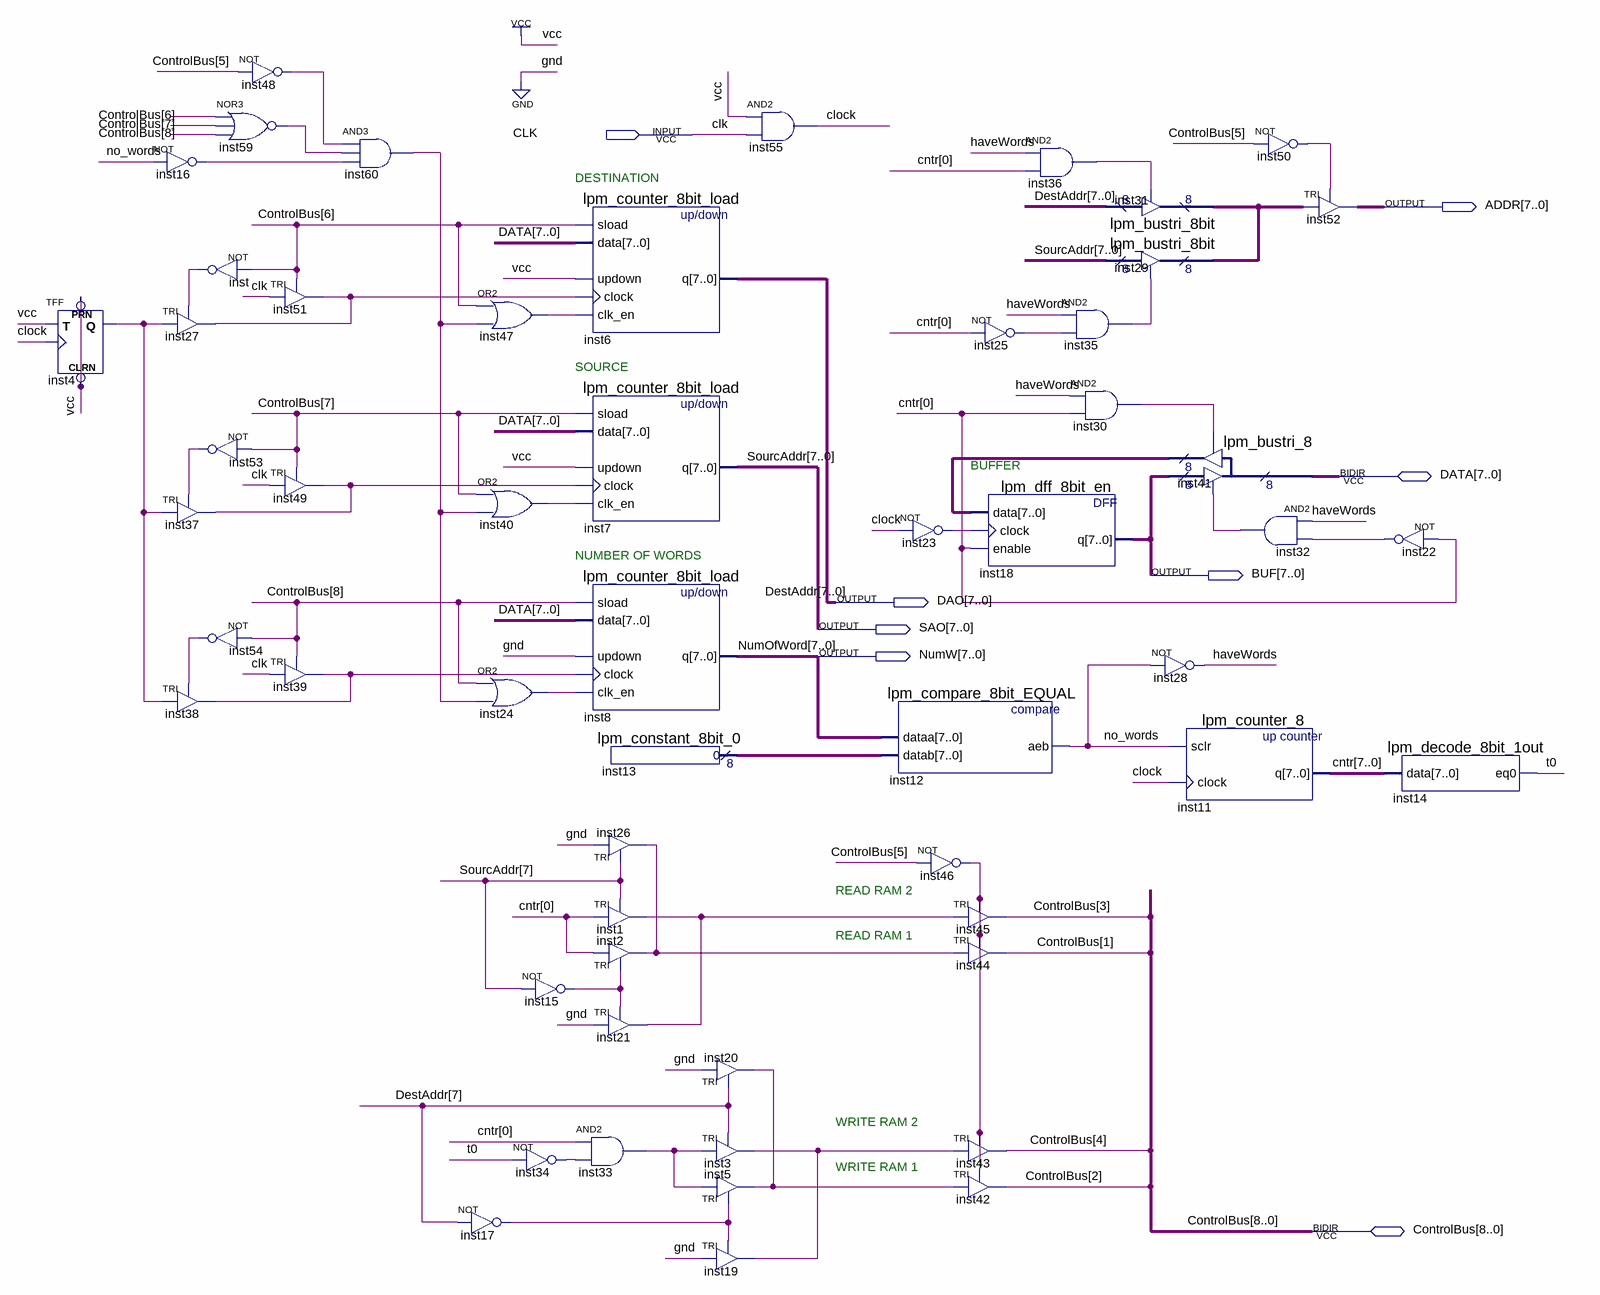
[diagram p0: schematic sheet]
// Quartus schematic DMA.bdf as structural Verilog: 56 symbols, 8 pins
module DMA (
  input  CLK,
  inout  [7:0] DATA,
  inout  [8:0] ControlBus,
  output [7:0] ADDR,
  output [7:0] BUF,
  output [7:0] DAO,
  output [7:0] SAO,
  output [7:0] NumW
);

  wire clock, haveWords, inst1_out, inst3_out, inst4_q, inst15_out, inst16_out, inst17_out, inst20_out,
       inst22_out, inst23_out, inst24_out, inst25_out, inst26_out, inst27_out, inst30_out, inst32_out,
       inst33_out, inst34_out, inst35_out, inst36_out, inst37_out, inst38_out, inst40_out, inst46_out,
       inst47_out, inst48_out, inst50_out, inst53_out, inst54_out, inst59_out, inst60_out, inst_out,
       no_words, t0;
  wire [7:0] cntr, inst13_result, inst31_tridata, inst41_result;

  TFF inst4 (.PRN(1'b1), .CLRN(1'b1), .T(1'b1), .CLK(clock), .Q(inst4_q));
  not inst16 (inst16_out, no_words);
  not inst (inst_out, ControlBus[6]);
  TRI inst27 (.IN(inst4_q), .OE(inst_out), .OUT(inst27_out));
  not inst53 (inst53_out, ControlBus[7]);
  TRI inst37 (.IN(inst4_q), .OE(inst53_out), .OUT(inst37_out));
  not inst54 (inst54_out, ControlBus[8]);
  TRI inst38 (.IN(inst4_q), .OE(inst54_out), .OUT(inst38_out));
  not inst48 (inst48_out, ControlBus[5]);
  nor inst59 (inst59_out, ControlBus[6], ControlBus[7], ControlBus[8]);
  TRI inst51 (.IN(CLK), .OE(ControlBus[6]), .OUT(inst27_out));
  TRI inst49 (.IN(CLK), .OE(ControlBus[7]), .OUT(inst37_out));
  TRI inst39 (.IN(CLK), .OE(ControlBus[8]), .OUT(inst38_out));
  and inst60 (inst60_out, inst48_out, inst59_out, inst16_out);
  or inst47 (inst47_out, ControlBus[6], inst60_out);
  or inst40 (inst40_out, ControlBus[7], inst60_out);
  or inst24 (inst24_out, ControlBus[8], inst60_out);
  not inst17 (inst17_out, DAO[7]);
  not inst15 (inst15_out, SAO[7]);
  not inst34 (inst34_out, t0);
  lpm_counter_8bit_load inst6 (
    .sload(ControlBus[6]), .data(DATA), .updown(1'b1), .clock(inst27_out), .clk_en(inst47_out), .q(DAO));
  lpm_counter_8bit_load inst7 (
    .sload(ControlBus[7]), .data(DATA), .updown(1'b1), .clock(inst37_out), .clk_en(inst40_out), .q(SAO));
  lpm_counter_8bit_load inst8 (
    .sload(ControlBus[8]), .data(DATA), .updown(1'b0), .clock(inst38_out), .clk_en(inst24_out), .q(NumW));
  lpm_constant_8bit_0 inst13 (.result(inst13_result));
  TRI inst26 (.IN(1'b0), .OE(SAO[7]), .OUT(inst26_out));
  TRI inst1 (.IN(cntr[0]), .OE(SAO[7]), .OUT(inst1_out));
  TRI inst2 (.IN(cntr[0]), .OE(inst15_out), .OUT(inst26_out));
  TRI inst21 (.IN(1'b0), .OE(inst15_out), .OUT(inst1_out));
  and inst33 (inst33_out, cntr[0], inst34_out);
  TRI inst20 (.IN(1'b0), .OE(DAO[7]), .OUT(inst20_out));
  TRI inst3 (.IN(inst33_out), .OE(DAO[7]), .OUT(inst3_out));
  TRI inst5 (.IN(inst33_out), .OE(inst17_out), .OUT(inst20_out));
  TRI inst19 (.IN(1'b0), .OE(inst17_out), .OUT(inst3_out));
  and inst55 (clock, 1'b1, CLK);
  not inst23 (inst23_out, clock);
  lpm_compare_8bit_EQUAL inst12 (.dataa(NumW), .datab(inst13_result), .aeb(no_words));
  not inst46 (inst46_out, ControlBus[5]);
  not inst25 (inst25_out, cntr[0]);
  lpm_dff_8bit_en inst18 (.data(inst41_result), .clock(inst23_out), .enable(cntr[0]), .q(BUF));
  TRI inst45 (.IN(inst1_out), .OE(inst46_out), .OUT(ControlBus[3]));
  TRI inst44 (.IN(inst26_out), .OE(inst46_out), .OUT(ControlBus[1]));
  TRI inst43 (.IN(inst3_out), .OE(inst46_out), .OUT(ControlBus[4]));
  TRI inst42 (.IN(inst20_out), .OE(inst46_out), .OUT(ControlBus[2]));
  and inst36 (inst36_out, haveWords, cntr[0]);
  and inst35 (inst35_out, haveWords, inst25_out);
  lpm_bustri_8bit inst31 (.enabledt(inst36_out), .data(DAO), .tridata(inst31_tridata));
  lpm_bustri_8bit inst29 (.enabledt(inst35_out), .data(SAO), .tridata(inst31_tridata));
  and inst30 (inst30_out, haveWords, cntr[0]);
  lpm_bustri_8 inst41 (
    .enabledt(inst32_out), .data(BUF), .enabletr(inst30_out), .result(inst41_result), .tridata(DATA));
  not inst28 (haveWords, no_words);
  lpm_counter_8 inst11 (.sclr(no_words), .clock(clock), .q(cntr));
  not inst50 (inst50_out, ControlBus[5]);
  and inst32 (inst32_out, haveWords, inst22_out);
  TRI inst52[7:0] (.IN(inst31_tridata), .OE(inst50_out), .OUT(ADDR));
  not inst22 (inst22_out, cntr[0]);
  lpm_decode_8bit_1out inst14 (.data(cntr), .eq0(t0));

  // Other names for the same wires on the sheet: DestAddr[7:0] = DAO; NumOfWord[7:0] = NumW; SourcAddr[7:0] = SAO

  // Notes on the sheet:
  //   DESTINATION
  //   SOURCE
  //   BUFFER
  //   NUMBER OF WORDS
  //   READ RAM 2
  //   READ RAM 1
  //   WRITE RAM 2
  //   WRITE RAM 1
endmodule
